# Altium schematic sheet USB-UART-Converter.SchDoc (part 1 of 3)
size A4; DocumentNumber: 3; SheetNumber: 3; SheetTotal: 3
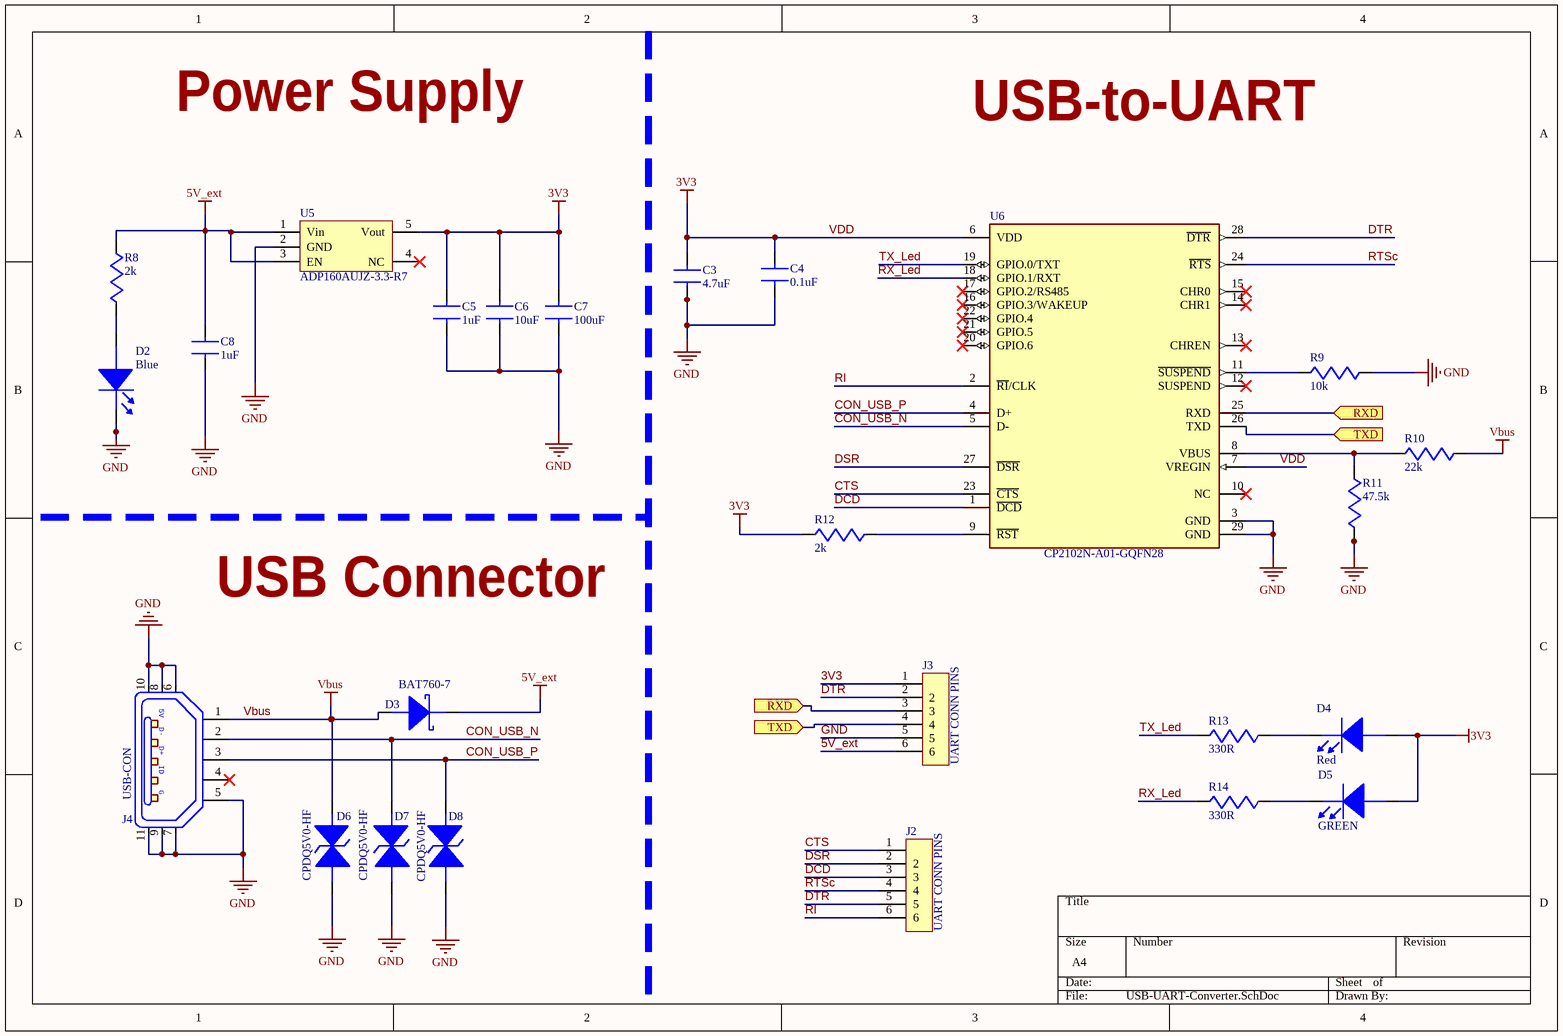
[diagram p0: USB-UART-Converter.SchDoc]

## Parts
C3  4.7uF  [C0603]
C4  0.1uF  [C0603]
C5  1uF  [C0603]
C6  10uF  [C0603]
C7  100uF  [C1206]
C8  1uF  [C0603]
D2  Blue  [LED_0603]
D3  BAT760-7  [SOD323]
D4  Red  [LED_0603]
D5  GREEN  [LED_0603]
D6  CPDQ5V0-HF  [SOD-923F]
D7  CPDQ5V0-HF  [SOD-923F]
D8  CPDQ5V0-HF  [SOD-923F]
J2  UART CONN PINS  [HDR_FEMALE_1x6_2.54mm]  (no BOM)
J3  UART CONN PINS  [HDR_FEMALE_1x6_2.54mm]  (no BOM)
J4  USB-CON  [10118193]
R8  2k  [R0603]
R9  10k  [R0603]
R10  22k  [R0603]
R11  47.5k  [R0603]
R12  2k  [R0603]
R13  330R  [R0603]
R14  330R  [R0603]
U5  ADP160AUJZ-3.3-R7  [SOT95]
U6  CP2102N-A01-GQFN28  [FP-CP2102N-A01-GQFN28-IPC_A]

## Ports
RXD (in), TXD (in)

## Nets
3V3: C3.2 C4.2 C5.2 C6.2 C7.2 D4.2(Anode) D5.2(Anode) J3.1 R12.1 U5.5(Vout) U6.6(VDD) U6.7(VREGIN)  [also labelled VDD]
5V_ext: C8.2 D3.1(Cathode) J3.6 R8.2 U5.1(Vin) U5.3(EN)
GND: C3.1 C4.1 C5.1 C6.1 C7.1 C8.1 D2.1(Cathode) D6.2(Anode) D7.2(Anode) D8.2(Anode) J3.5 J4.5 J4.6 J4.7 J4.8 J4.9 J4.10 J4.11 R9.2 R11.1 U5.2(GND) U6.3(GND) U6.29(GND)
Vbus: D3.2(Anode) D6.1(Cathode) J4.1 R10.2
CON_USB_N: D7.1(Cathode) J4.2 U6.5(D-)
CON_USB_P: D8.1(Cathode) J4.3 U6.4(D+)
CTS: J2.1 U6.23(~{CTS})
DCD: J2.3 U6.1(~{DCD})
DSR: J2.2 U6.27(~{DSR})
DTR: J2.5 J3.2 U6.28(~{DTR})
RI: J2.6 U6.2(~{RI}/CLK)
RTSc: J2.4 U6.24(~{RTS})
RX_Led: R14.1 U6.18(GPIO.1/RXT)
RXD: J3.3 U6.25(RXD) ; port RXD
TX_Led: R13.1 U6.19(GPIO.0/TXT)
TXD: J3.4 U6.26(TXD) ; port TXD
NetD2_2: D2.2(Anode) R8.1
NetD4_1: D4.1(Cathode) R13.2
NetD5_1: D5.1(Cathode) R14.2
NetR9_1: R9.1 U6.11(~{SUSPEND})
NetR10_1: R10.1 R11.2 U6.8(VBUS)
NetR12_2: R12.2 U6.9(~{RST})

Not connected (* = marked no-connect by the designer): J4 4*; U5 4(NC)*; U6 10(NC)* 12(SUSPEND)* 13(CHREN)* 14(CHR1)* 15(CHR0)* 16(GPIO.3/WAKEUP)* 17(GPIO.2/RS485)* 20(GPIO.6)* 21(GPIO.5)* 22(GPIO.4)*

## Notes on the sheet
- Power Supply
- USB-to-UART
- USB Connector
- (in symbol 10118193-0001LF) 5V; D-; D+; ID; G